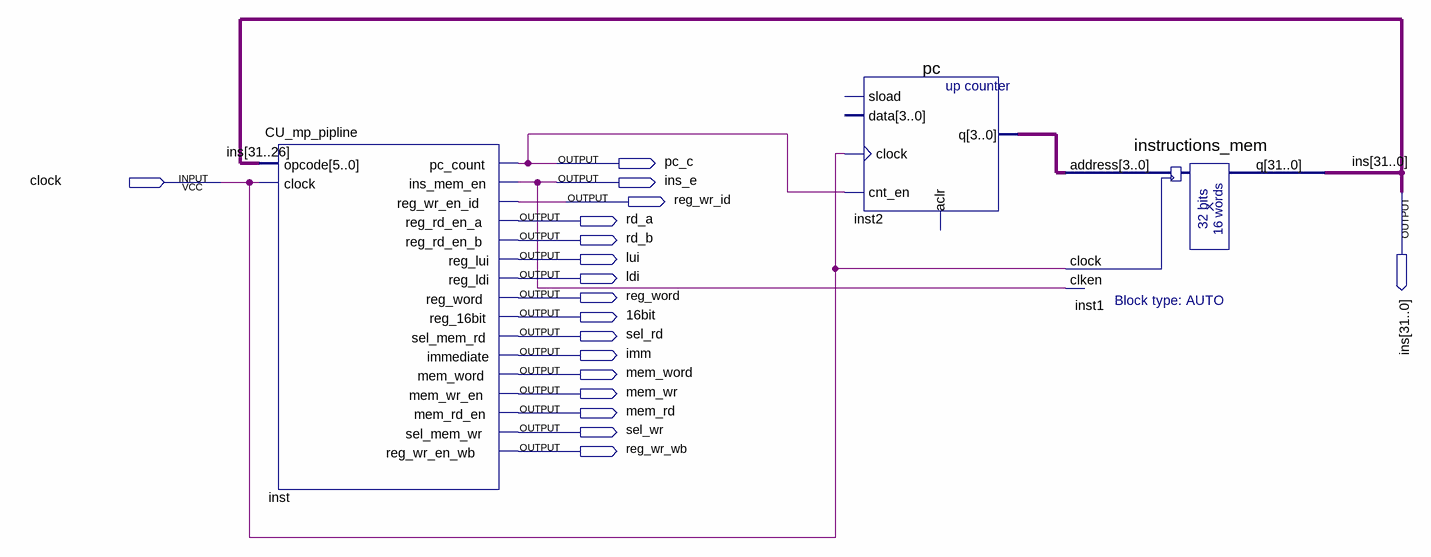
[diagram p0: schematic sheet]
// Quartus schematic test_cu_pipline.bdf as structural Verilog: 3 symbols, 18 pins
module test_cu_pipline (
  input  clock,
  output pc_c,
  output ins_e,
  output [31:0] ins,
  output reg_wr_id,
  output rd_a,
  output rd_b,
  output lui,
  output ldi,
  output reg_word,
  output \16bit ,
  output sel_rd,
  output imm,
  output mem_word,
  output mem_wr,
  output mem_rd,
  output sel_wr,
  output reg_wr_wb
);

  wire [3:0] inst2_q;

  CU_mp_pipline inst (
    .opcode(ins[31:26]), .clock(clock), .pc_count(pc_c), .ins_mem_en(ins_e), .reg_wr_en_id(reg_wr_id),
    .reg_rd_en_a(rd_a), .reg_rd_en_b(rd_b), .reg_lui(lui), .reg_ldi(ldi), .reg_word(reg_word),
    .reg_16bit(\16bit ), .sel_mem_rd(sel_rd), .immediate(imm), .mem_word(mem_word), .mem_wr_en(mem_wr),
    .mem_rd_en(mem_rd), .sel_mem_wr(sel_wr), .reg_wr_en_wb(reg_wr_wb));
  pc inst2 (.clock(clock), .cnt_en(pc_c), .q(inst2_q));  // open: sload, data, aclr
  instructions_mem inst1 (.address(inst2_q), .clock(clock), .clken(ins_e), .q(ins));
endmodule
